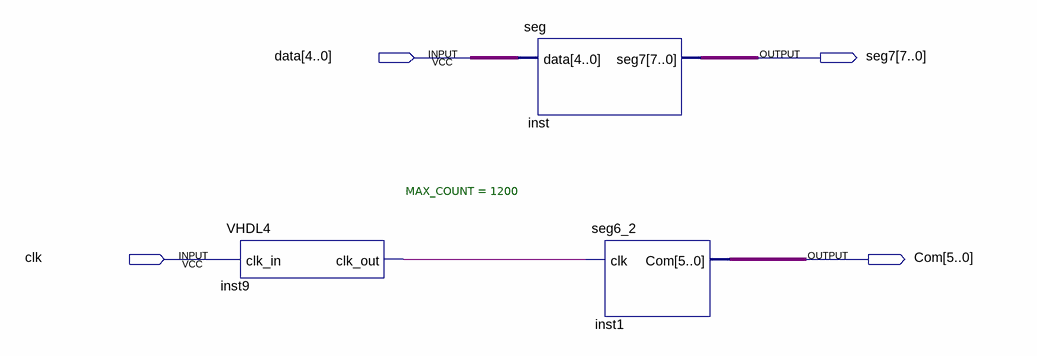
[diagram p0: schematic sheet]
// Quartus schematic VHDL3_2.bdf as structural Verilog: 3 symbols, 4 pins
module VHDL3_2 (
  input  [4:0] data,
  input  clk,
  output [7:0] seg7,
  output [5:0] Com
);

  wire inst9_clk_out;

  VHDL4 #(.MAX_COUNT(1200)) inst9 (.clk_in(clk), .clk_out(inst9_clk_out));
  seg inst (.data(data), .seg7(seg7));
  seg6_2 inst1 (.clk(inst9_clk_out), .Com(Com));
endmodule
